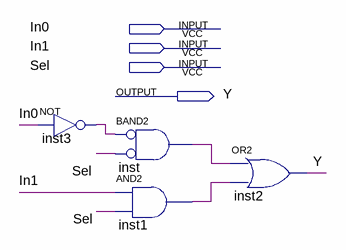
[diagram p0: schematic sheet]
// Quartus schematic mux2to1.bdf as structural Verilog: 4 symbols, 4 pins
module mux2to1 (
  input  In0,
  input  In1,
  input  Sel,
  output Y
);

  wire inst1_out, inst3_out, inst_out;

  not inst3 (inst3_out, In0);
  and inst (inst_out, ~inst3_out, ~Sel);  // BAND2
  and inst1 (inst1_out, In1, Sel);
  or inst2 (Y, inst_out, inst1_out);
endmodule
